# Altium schematic sheet IMX7S_SENSORS_&_EXTERNAL_INTERFACES.SchDoc
size A3
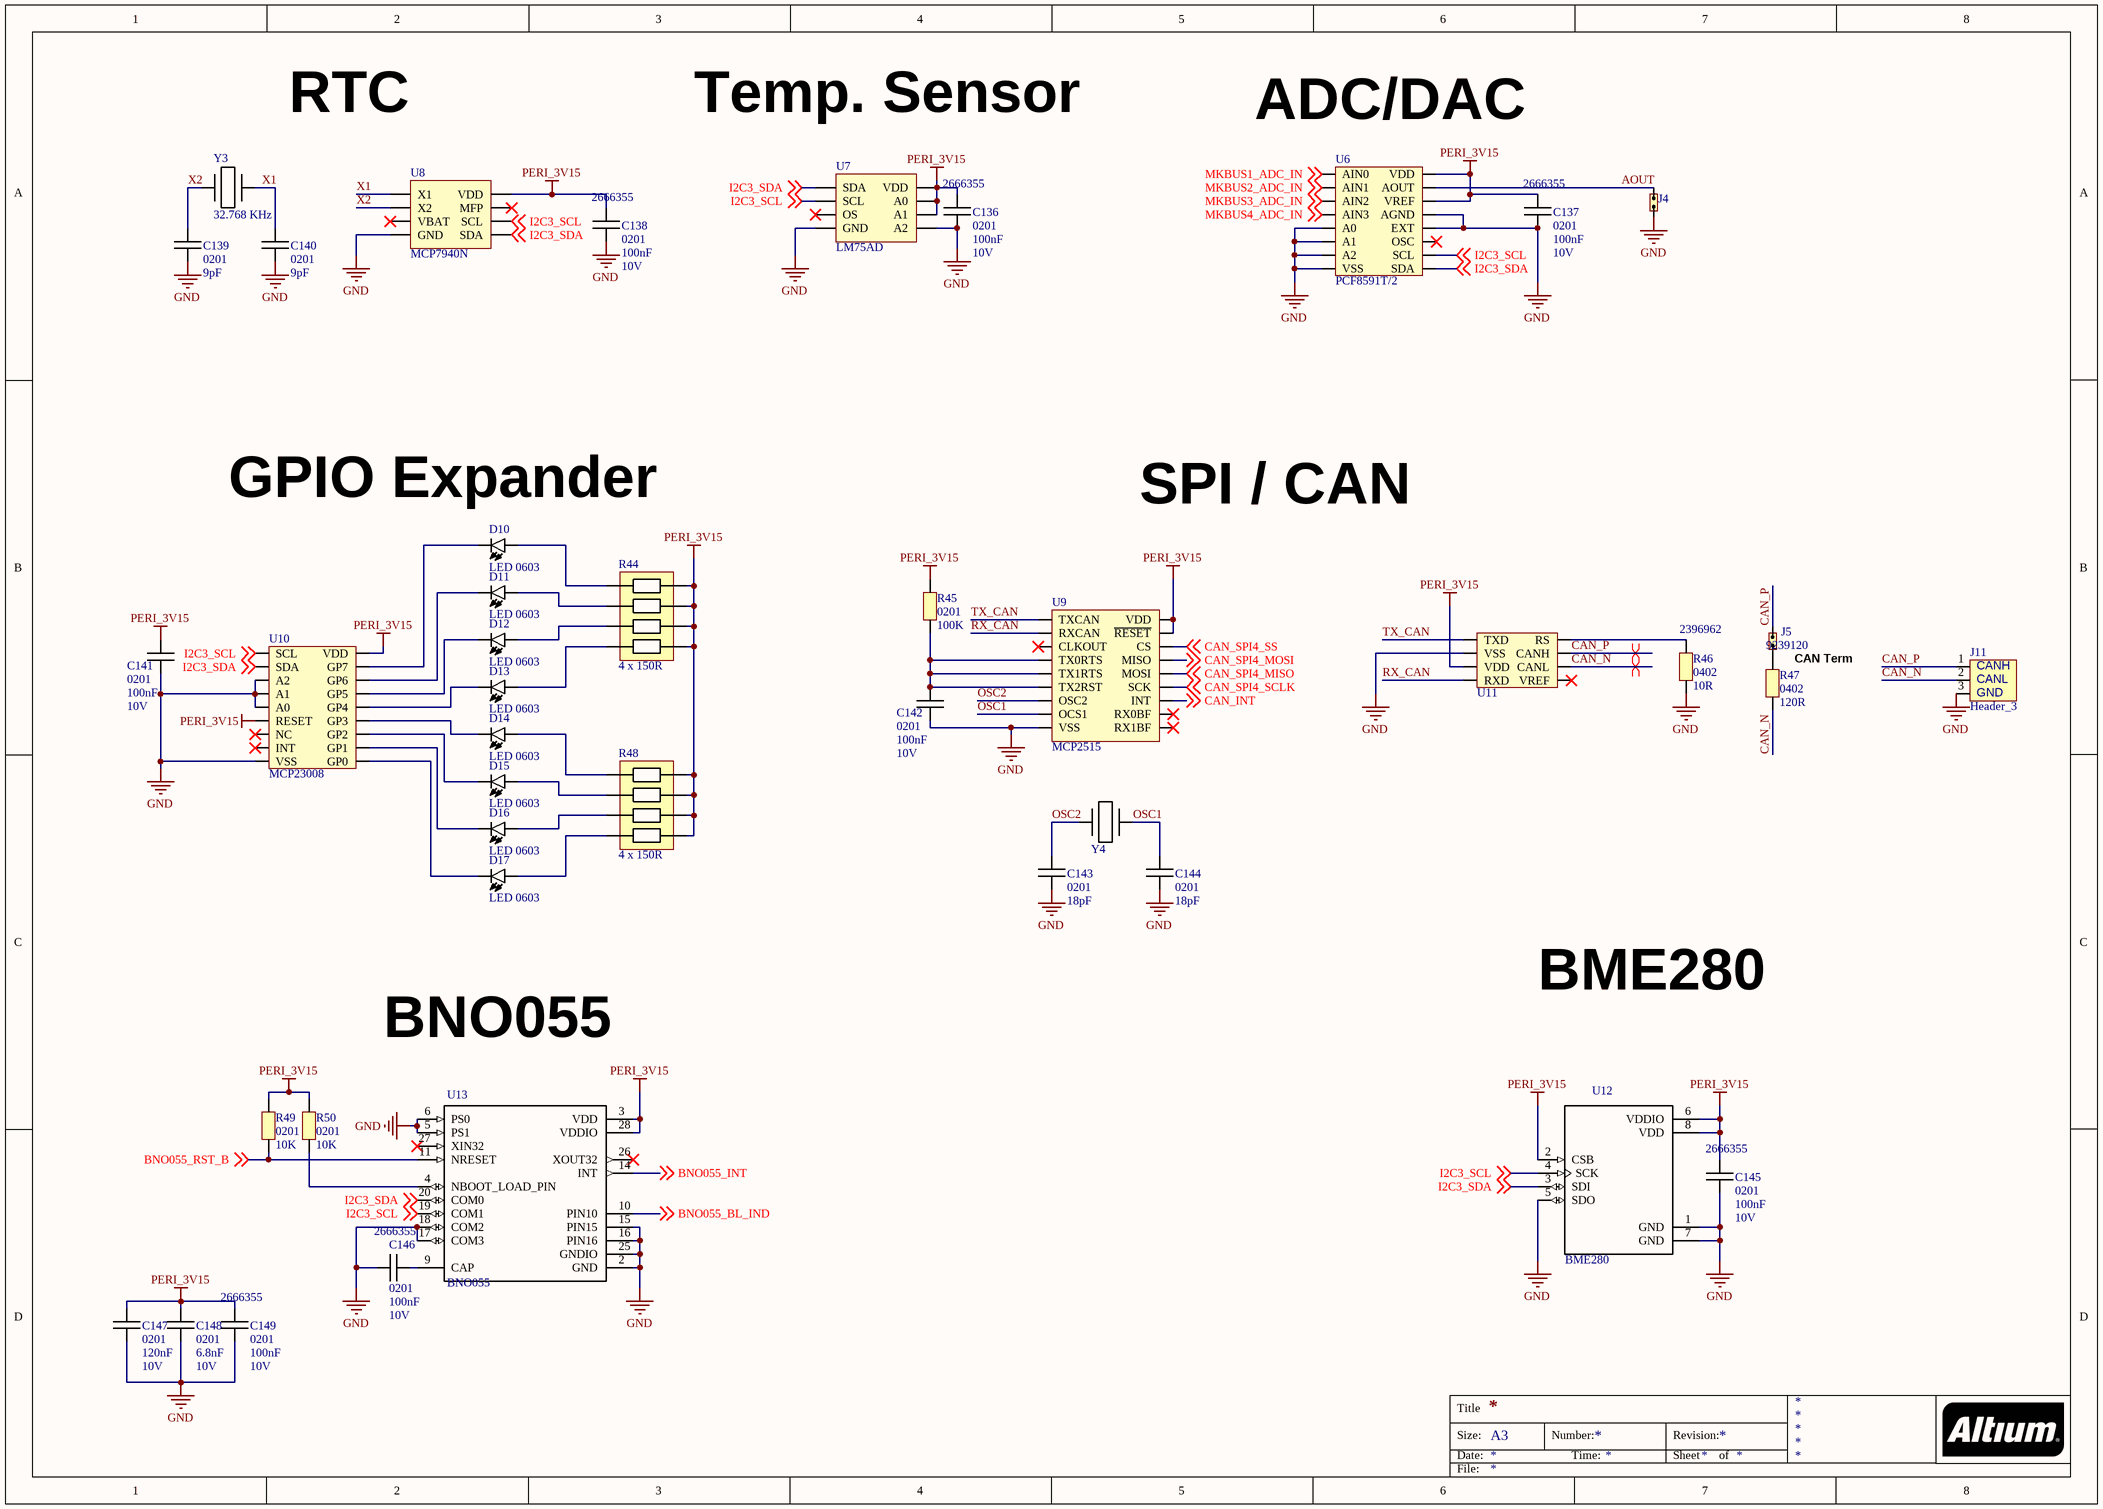
[diagram p0: IMX7S_SENSORS_&_EXTERNAL_INTERFACES.SchDoc]

## Parts
C136  value 100nF  PACKAGE: 0201  VOLTAGE: 10V  Supplier Part Number 1: 2666355  [C0201]  (hidden comment: C0201)
C137  value 100nF  PACKAGE: 0201  VOLTAGE: 10V  Supplier Part Number 1: 2666355  [C0201]  (hidden comment: C0201)
C138  value 100nF  PACKAGE: 0201  VOLTAGE: 10V  Supplier Part Number 1: 2666355  [C0201]  (hidden comment: C0201)
C139  value 9pF  PACKAGE: 0201  [C0201]  (hidden comment: C0201)
C140  value 9pF  PACKAGE: 0201  [C0201]  (hidden comment: C0201)
C141  value 100nF  PACKAGE: 0201  VOLTAGE: 10V  [C0201]  (hidden comment: C0201)
C142  value 100nF  PACKAGE: 0201  VOLTAGE: 10V  [C0201]  (hidden comment: C0201)
C143  value 18pF  PACKAGE: 0201  [C0201]  (hidden comment: C0201)
C144  value 18pF  PACKAGE: 0201  [C0201]  (hidden comment: C0201)
C145  value 100nF  PACKAGE: 0201  VOLTAGE: 10V  Supplier Part Number 1: 2666355  [C0201]  (hidden comment: C0201)
C146  value 100nF  PACKAGE: 0201  VOLTAGE: 10V  Supplier Part Number 1: 2666355  [C0201]  (hidden comment: C0201)
C147  value 120nF  PACKAGE: 0201  VOLTAGE: 10V  [C0201]  (hidden comment: C0201)
C148  value 6.8nF  PACKAGE: 0201  VOLTAGE: 10V  [C0201]  (hidden comment: C0201)
C149  value 100nF  PACKAGE: 0201  VOLTAGE: 10V  Supplier Part Number 1: 2666355  [C0201]  (hidden comment: C0201)
D10  LED 0603  [D0603]
D11  LED 0603  [D0603]
D12  LED 0603  [D0603]
D13  LED 0603  [D0603]
D14  LED 0603  [D0603]
D15  LED 0603  [D0603]
D16  LED 0603  [D0603]
D17  LED 0603  [D0603]
J4  Jumper  [Header 2]  (value not drawn)
J5  Jumper  [Header 2]  (value not drawn)
J11  Header_3  [Header 3]
R44  4 x 150R  [Reseau_R_1206]
R45  value 100K  PACKAGE: 0201  [R0201]  (hidden comment: R0201)
R46  value 10R  PACKAGE: 0402  Supplier Part Number 1: 2396962  [R0402]  (hidden comment: R0402)
R47  value 120R  PACKAGE: 0402  Supplier Part Number 1: 9239120  [R0402]  (hidden comment: R0402)
R48  4 x 150R  [Reseau_R_1206]
R49  value 10K  PACKAGE: 0201  [R0201]  (hidden comment: R0201)
R50  value 10K  PACKAGE: 0201  [R0201]  (hidden comment: R0201)
U6  PCF8591T/2  [SOIC 16]
U7  LM75AD  [SOIC 8]
U8  MCP7940N  [SOIC 8]
U9  MCP2515  [SOIC 18]
U10  MCP23008  [SOIC 18]
U11  SN65HVD230DR  [SOIC 8]  (value not drawn)
U12  BME280  [PSON65P250X250X100-8N]
U13  BNO055  [LGA28R50P4X10_380X520X100]
Y3  32.768 KHz  [ABS07]
Y4  Quartz 8MHz  [HC49]  (value not drawn)

## Nets
GND: C136.2 C137.2 C138.2 C139.1 C140.1 C141.2 C142.2 C143.1 C144.1 C145.1 C146.2 C147.2 C148.2 C149.2 J4.1 J11.3 R46.2 U6.5(A0) U6.6(A1) U6.7(A2) U6.8(VSS) U6.12(EXT) U6.13(AGND) U7.4(GND) U7.5(A2) U8.4(GND) U9.9(VSS) U10.3(A2) U10.4(A1) U10.5(A0) U10.9(VSS) U11.2(VSS) U12.1(GND) U12.5(SDO) U12.7(GND) U13.2(GND) U13.5(PS1) U13.6(PS0) U13.15(PIN15) U13.16(PIN16) U13.17(COM3) U13.18(COM2) U13.25(GNDIO)
PERI_3V15: C136.1 C137.1 C138.1 C141.1 C145.2 C147.1 C148.1 C149.1 R44.1 R44.2 R44.3 R44.4 R45.2 R48.1 R48.2 R48.3 R48.4 R49.2 R50.2 U6.14(VREF) U6.16(VDD) U7.6(A1) U7.7(A0) U7.8(VDD) U8.8(VDD) U9.17(~{RESET}) U9.18(VDD) U10.6(RESET) U10.18(VDD) U11.3(VDD) U12.2(CSB) U12.6(VDDIO) U12.8(VDD) U13.3(VDD) U13.28(VDDIO)
AOUT: J4.2 U6.15(AOUT)
BNO055_BL_IND: U13.10(PIN10) ; off-sheet BNO055_BL_IND
BNO055_INT: U13.14(INT) ; off-sheet BNO055_INT
BNO055_RST_B: R49.1 U13.11(NRESET) ; off-sheet BNO055_RST_B
CAN_INT: U9.12(INT) ; off-sheet CAN_INT
CAN_N: J11.2 R47.1 U11.6(CANL)
CAN_P: J5.2 J11.1 U11.7(CANH)
CAN_SPI4_MISO: U9.14(MOSI) ; off-sheet CAN_SPI4_MISO
CAN_SPI4_MOSI: U9.15(MISO) ; off-sheet CAN_SPI4_MOSI
CAN_SPI4_SCLK: U9.13(SCK) ; off-sheet CAN_SPI4_SCLK
CAN_SPI4_SS: U9.16(CS) ; off-sheet CAN_SPI4_SS
I2C3_SCL: U6.10(SCL) U7.2(SCL) U8.6(SCL) U10.1(SCL) U12.4(SCK) U13.19(COM1) ; off-sheet I2C3_SCL
I2C3_SDA: U6.9(SDA) U7.1(SDA) U8.5(SDA) U10.2(SDA) U12.3(SDI) U13.20(COM0) ; off-sheet I2C3_SDA
MKBUS1_ADC_IN: U6.1(AIN0) ; off-sheet MKBUS1_ADC_IN
MKBUS2_ADC_IN: U6.2(AIN1) ; off-sheet MKBUS2_ADC_IN
MKBUS3_ADC_IN: U6.3(AIN2) ; off-sheet MKBUS3_ADC_IN
MKBUS4_ADC_IN: U6.4(AIN3) ; off-sheet MKBUS4_ADC_IN
OSC1: C144.2 U9.8(OCS1) Y4.2
OSC2: C143.2 U9.7(OSC2) Y4.1
RX_CAN: U9.2(RXCAN) U11.4(RXD)
TX_CAN: U9.1(TXCAN) U11.1(TXD)
X1: C140.2 U8.1(X1) Y3.2
X2: C139.2 U8.2(X2) Y3.1
NetC142_1: C142.1 R45.1 U9.4(TX0RTS) U9.5(TX1RTS) U9.6(TX2RST)
NetC146_1: C146.1 U13.9(CAP)
NetD10_1: D10.1(A) R44.5
NetD10_2: D10.2(K) U10.17(GP7)
NetD11_1: D11.1(A) R44.6
NetD11_2: D11.2(K) U10.16(GP6)
NetD12_1: D12.1(A) R44.7
NetD12_2: D12.2(K) U10.15(GP5)
NetD13_1: D13.1(A) R44.8
NetD13_2: D13.2(K) U10.14(GP4)
NetD14_1: D14.1(A) R48.5
NetD14_2: D14.2(K) U10.13(GP3)
NetD15_1: D15.1(A) R48.6
NetD15_2: D15.2(K) U10.12(GP2)
NetD16_1: D16.1(A) R48.7
NetD16_2: D16.2(K) U10.11(GP1)
NetD17_1: D17.1(A) R48.8
NetD17_2: D17.2(K) U10.10(GP0)
NetJ5_1: J5.1 R47.2
NetR46_1: R46.1 U11.8(RS)
NetR50_1: R50.1 U13.4(NBOOT_LOAD_PIN)

Not connected (* = marked no-connect by the designer): U6 11(OSC)*; U7 3(OS)*; U8 3(VBAT)* 7(MFP)*; U9 3(CLKOUT)* 10(RX1BF)* 11(RX0BF)*; U10 7(NC)* 8(INT)*; U11 5(VREF)*; U13 26(XOUT32)* 27(XIN32)*

## Layout directives
differential pair: CAN_N, CAN_P

## Notes on the sheet
- RTC
- Temp. Sensor
- (near U6) ADC/DAC
- (near D10) GPIO Expander
- SPI / CAN
- CAN Term
- BNO055
- BME280
- Title
- Size:
- Date:
- A3
- Number:
- Time:
- Revision:
- Sheet
- of
- File:
- (in symbol Header_3) CANH; CANL; GND

## Library data of the parts
C136-C138 C145 C146 C149 = C0201: Manufacturer 1: Murata; Manufacturer Part Number 1: GRM033R61A104KE15D; Dielectric: X5R; Tolerance: 10%; Supplier 1: Farnell; Stock 1: 2430000; Pricing 1: 15000=0,00510, 75000=0,00310 (EUR); RoHS: Yes; Mount: Surface Mount; Case/Package: 0201; Weight: 6E-06oz; Case Code (Metric): 0603; Case Code (Imperial): 0201; Min Operating Temperature: -55°C; Max Operating Temperature: 85°C; Packaging: Tape and Reel; Capacitance: 100nF; Package Quantity: 1; Voltage Rating (DC): 10V; Termination: SMD/SMT; Voltage Rating: 10V; Length: 0.6mm; Height: 0.3mm; Width: 0.012inch; Thickness: 0.013inch; Depth: 0.3mm; Radiation Hardening: No; REACH SVHC: No SVHC; Lead Free: Lead Free; ComponentLink1URL: https://datasheet.ciiva.com/26843/getdatasheetpartid-308656-26843739.pdf?src-supplier=Verical; ComponentLink1Description: https://datasheet.ciiva.com/26843/getdatasheetpartid-308656-26843739.pdf?src-supplier=Verical; ComponentLink2URL: https://datasheet.ciiva.com/5413/product-5413117.pdf?src-supplier=Mouser; ComponentLink2Description: https://datasheet.ciiva.com/5413/product-5413117.pdf?src-supplier=Mouser; ComponentLink3URL: https://datasheet.ciiva.com/6256/partnumbering-e-01-6256406.pdf?src-supplier=Digi-Key; ComponentLink3Description: https://datasheet.ciiva.com/6256/partnumbering-e-01-6256406.pdf?src-supplier=Digi-Key; ComponentLink4URL: https://datasheet.ciiva.com/6256/partnumbering-e-01-6256408.pdf?src-supplier=Digi-Key; ComponentLink4Description: https://datasheet.ciiva.com/6256/partnumbering-e-01-6256408.pdf?src-supplier=Digi-Key; ComponentLink5URL: https://datasheet.ciiva.com/6256/partnumbering-e-01-6256407.pdf?src-supplier=Digi-Key; ComponentLink5Description: https://datasheet.ciiva.com/6256/partnumbering-e-01-6256407.pdf?src-supplier=Digi-Key
C139 C140 = C0201: Manufacturer 1: TDK; Manufacturer Part Number 1: CGA1A2C0G1E090D030BA; VOLTAGE: 0V; Description: CAP CER 9PF 25V C0G 0201; Voltage Rating: 25V; Dielectric: C0G; Supplier 1: RSComponents; Supplier Part Number 1: 1447034; Stock 1: 15000; Pricing 1: 15000=0,00900 (EUR); RoHS: Yes; Mount: Surface Mount; Case/Package: 0201; Weight: 6E-06oz; Case Code (Metric): 0603; Case Code (Imperial): 0201; Min Operating Temperature: -55°C; Max Operating Temperature: 125°C; Package Quantity: 1; Packaging: Tape and Reel; Capacitance: 9pF; Voltage Rating (DC): 25V; Termination: SMD/SMT; Composition: Ceramic; Length: 0.024inch; Height: 0.3mm; Width: 0.012inch; Thickness: 0.012inch; Ratings: AEC-Q200; ComponentLink1URL: http://www.mouser.com/ds/2/400/lcc_automotive_general_en-843974.pdf?src-supplier=Mouser; ComponentLink1Description: http://www.mouser.com/ds/2/400/lcc_automotive_general_en-843974.pdf?src-supplier=Mouser; ComponentLink2URL: https://product.tdk.com/info/en/documents/chara_sheet/CGA1A2C0G1E090D030BA.pdf?src-supplier=Digi-Key; ComponentLink2Description: https://product.tdk.com/info/en/documents/chara_sheet/CGA1A2C0G1E090D030BA.pdf?src-supplier=Digi-Key; ComponentLink3URL: https://product.tdk.com/info/en/catalog/datasheets/mlcc_automotive_general_en.pdf?src-supplier=Digi-Key; ComponentLink3Description: https://product.tdk.com/info/en/catalog/datasheets/mlcc_automotive_general_en.pdf?src-supplier=Digi-Key; ComponentLink4URL: http://product.tdk.com/capacitor/mlcc/en/documents/mlcc_automotive_general_en.pdf?src-supplier=Avnet; ComponentLink4Description: http://product.tdk.com/capacitor/mlcc/en/documents/mlcc_automotive_general_en.pdf?src-supplier=Avnet
C143 C144 = C0201: Manufacturer 1: Murata; Manufacturer Part Number 1: GRM0335C1H180GA01D; VOLTAGE: 10V; Description: 0201 18 pF 50 V ±2% Tolerance C0G/NP0 Multilayer Ceramic Capacitor; Voltage Rating: 50V; Tolerance: 2%; Supplier 1: Farnell; Supplier Part Number 1: 2990623; Stock 1: 11590; Pricing 1: 10=0,02610, 100=0,01320, 500=0,00970, 2500=0,00770, 7500=0,00570, 15000=0,00460, 75000=0,00310 (EUR); RoHS: Yes; Mount: Surface Mount; Case/Package: 0201; Case Code (Metric): 0603; Case Code (Imperial): 0201; Min Operating Temperature: -55°C; Max Operating Temperature: 125°C; Package Quantity: 15000; Packaging: Tape and Reel; Capacitance: 18pF; Termination: SMD/SMT; Voltage Rating (DC): 50V; Length: 0.024inch; Width: 0.012inch; Thickness: 0.013inch; ComponentLink1URL: http://www.mouser.com/ds/2/281/c02e-2905.pdf?src-supplier=Mouser; ComponentLink1Description: http://www.mouser.com/ds/2/281/c02e-2905.pdf?src-supplier=Mouser; ComponentLink2URL: http://search.murata.co.jp/Ceramy/image/img/A01X/partnumbering_e_01.pdf?src-supplier=Digi-Key; ComponentLink2Description: http://search.murata.co.jp/Ceramy/image/img/A01X/partnumbering_e_01.pdf?src-supplier=Digi-Key; ComponentLink3URL: http://search.murata.co.jp/Ceramy/image/img/A01X/G101/ENG/GRM0335C1H180GA01-01.pdf?src-supplier=Digi-Key; ComponentLink3Description: http://search.murata.co.jp/Ceramy/image/img/A01X/G101/ENG/GRM0335C1H180GA01-01.pdf?src-supplier=Digi-Key
D10-D17 = LED: Manufacturer 1: Dialight; Manufacturer Part Number 1: 597-5112-407F; Color: Red; Lens Color: White; Luminous Intensity: 11.7mcd; Viewing Angle: 152°; Forward Voltage: 1.7V; Wavelength: 660nm; Lens Style: Rectangular,Diffused; Forward Current: 20mA; Lens Transparency: Diffused; Dominant Wavelength: 647nm; Number of Elements: 1; Power Dissipation: 57.5mW; Supplier 1: Farnell; Supplier Part Number 1: 2410206; Stock 1: 4000; Pricing 1: 4000=0,23100, 8000=0,22100, 16000=0,21300 (EUR); RoHS: Yes; Mount: Surface Mount; Case/Package: 0603; Number of Pins: 2; Case Code (Metric): 1608; Case Code (Imperial): 0603; Min Operating Temperature: -30°C; Max Operating Temperature: 85°C; Packaging: Tape and Reel; Package Quantity: 1; Illumination Color: Red; Test Current: 20mA; Voltage Rating (DC): 1.7V; Input Current: 20mA; Number of LEDs: 1; Length: 1.6mm; Height: 0.7mm; Width: 0.8mm; Depth: 0.8mm; Radiation Hardening: No; REACH SVHC: No SVHC; Lead Free: Lead Free; ComponentLink1URL: https://datasheet.ciiva.com/15117/getdatasheetpartid-87981-15117375.pdf?src-supplier=Verical; ComponentLink1Description: https://datasheet.ciiva.com/15117/getdatasheetpartid-87981-15117375.pdf?src-supplier=Verical; ComponentLink2URL: https://datasheet.ciiva.com/4688/c16413e-14555-4688795.pdf?src-supplier=Mouser; ComponentLink2Description: https://datasheet.ciiva.com/4688/c16413e-14555-4688795.pdf?src-supplier=Mouser; ComponentLink3URL: https://datasheet.ciiva.com/2111/c16413-2111592.pdf?src-supplier=Digi-Key; ComponentLink3Description: https://datasheet.ciiva.com/2111/c16413-2111592.pdf?src-supplier=Digi-Key; ComponentLink4URL: https://datasheet.ciiva.com/16214/597-xxxx-4xx-16214360.pdf?src-supplier=Future+Electronics; ComponentLink4Description: https://datasheet.ciiva.com/16214/597-xxxx-4xx-16214360.pdf?src-supplier=Future+Electronics; ComponentLink5URL: https://datasheet.ciiva.com/30210/597-xxxx-4xx-30210171.pdf?src-supplier=Onlinecomponents.com; ComponentLink5Description: https://datasheet.ciiva.com/30210/597-xxxx-4xx-30210171.pdf?src-supplier=Onlinecomponents.com; ComponentLink6URL: https://datasheet.ciiva.com/16011/597-xxxx-4xx-16011468.pdf?src-supplier=Onlinecomponents.com; ComponentLink6Description: https://datasheet.ciiva.com/16011/597-xxxx-4xx-16011468.pdf?src-supplier=Onlinecomponents.com; ComponentLink7URL: https://datasheet.ciiva.com/2111/c16413-2111593.pdf?src-supplier=Digi-Key; ComponentLink7Description: https://datasheet.ciiva.com/2111/c16413-2111593.pdf?src-supplier=Digi-Key; ComponentLink8URL: https://datasheet.ciiva.com/2111/c16413-2111594.pdf?src-supplier=Digi-Key; ComponentLink8Description: https://datasheet.ciiva.com/2111/c16413-2111594.pdf?src-supplier=Digi-Key
R44 R48 = Reseau_res
R45 R49 R50 = R0201: VOLTAGE: 0V
R46 = R0402: Manufacturer 1: Panasonic; Manufacturer Part Number 1: ERJ-2RKF10R0X; VOLTAGE: 0V; Power Rating: 100mW; Tolerance: 1%; Voltage Rating: 50V; Temperature Coefficient: 100ppm/°C; Supplier 1: Farnell; Stock 1: 140000; Pricing 1: 10000=0,00410, 50000=0,00400 (GBP); RoHS: Yes; Mount: Surface Mount; Case/Package: 0402; Number of Pins: 2; Case Code (Imperial): 0402; Case Code (Metric): 1005; Contact Plating: Tin; Min Operating Temperature: -55°C; Max Operating Temperature: 155°C; Resistance: 10R; Packaging: Tape and Reel; Package Quantity: 1; Termination: SMD/SMT; Composition: Thick Film; Number of Terminations: 2; Military Standard: Not; Max Power Dissipation: 100mW; Voltage Rating (DC): 50V; Features: Automotive AEC-Q200; Length: 1mm; Height: 0.35mm; Width: 0.5mm; Depth: 0.5mm; Radiation Hardening: No; REACH SVHC: No SVHC; Lead Free: Lead Free; ComponentLink1URL: https://datasheet.ciiva.com/11821/0900766b80f80784-11821168.pdf?src-supplier=RSComponents; ComponentLink1Description: https://datasheet.ciiva.com/11821/0900766b80f80784-11821168.pdf?src-supplier=RSComponents; ComponentLink2URL: https://datasheet.ciiva.com/9194/aoa0000ce2-9194120.pdf?src-supplier=Avnet; ComponentLink2Description: https://datasheet.ciiva.com/9194/aoa0000ce2-9194120.pdf?src-supplier=Avnet; ComponentLink3URL: https://datasheet.ciiva.com/30218/aoa0000ce2-30218536.pdf?src-supplier=Onlinecomponents.com; ComponentLink3Description: https://datasheet.ciiva.com/30218/aoa0000ce2-30218536.pdf?src-supplier=Onlinecomponents.com; ComponentLink4URL: https://datasheet.ciiva.com/17212/aoa0000ce2-17212057.pdf?src-supplier=Avnet+Europe; ComponentLink4Description: https://datasheet.ciiva.com/17212/aoa0000ce2-17212057.pdf?src-supplier=Avnet+Europe; ComponentLink5URL: https://datasheet.ciiva.com/24071/aoa0000ce2-24071514.pdf?src-supplier=Mouser; ComponentLink5Description: https://datasheet.ciiva.com/24071/aoa0000ce2-24071514.pdf?src-supplier=Mouser; ComponentLink6URL: https://datasheet.ciiva.com/27055/1987054-27055644.pdf?src-supplier=Jameco; ComponentLink6Description: https://datasheet.ciiva.com/27055/1987054-27055644.pdf?src-supplier=Jameco; ComponentLink7URL: https://datasheet.ciiva.com/7802/aoa0000ce2-7802405.pdf?src-supplier=Element14; ComponentLink7Description: https://datasheet.ciiva.com/7802/aoa0000ce2-7802405.pdf?src-supplier=Element14; ComponentLink8URL: https://datasheet.ciiva.com/16773/70260748-16773366.pdf?src-supplier=Allied+Electronics; ComponentLink8Description: https://datasheet.ciiva.com/16773/70260748-16773366.pdf?src-supplier=Allied+Electronics; ComponentLink9URL: https://datasheet.ciiva.com/43467/1678782-43467127.pdf?src-supplier=Farnell; ComponentLink9Description: https://datasheet.ciiva.com/43467/1678782-43467127.pdf?src-supplier=Farnell; ComponentLink10URL: https://datasheet.ciiva.com/6082/aoa0000ce2-6082046.pdf?src-supplier=Farnell; ComponentLink10Description: https://datasheet.ciiva.com/6082/aoa0000ce2-6082046.pdf?src-supplier=Farnell; ComponentLink11URL: https://datasheet.ciiva.com/22668/1678782-22668302.pdf?src-supplier=Element14; ComponentLink11Description: https://datasheet.ciiva.com/22668/1678782-22668302.pdf?src-supplier=Element14
R47 = R0402: Manufacturer 1: Yageo; Manufacturer Part Number 1: RC0402FR-07120RL; VOLTAGE: 0V; Tolerance: 1%; Power Rating: 62.5mW; Voltage Rating: 50V; Temperature Coefficient: 100ppm/°C; Max Power Dissipation: 63mW; Supplier 1: Farnell; Stock 1: 77592; Pricing 1: 10=0,01610, 100=0,01570, 500=0,01180, 2500=0,00590, 5000=0,00500, 10000=0,00400, 50000=0,00300 (EUR); RoHS: Yes; Case/Package: 0402; Case Code (Imperial): 0402; Case Code (Metric): 1005; Min Operating Temperature: -55°C; Max Operating Temperature: 155°C; Package Quantity: 1; Resistance: 120R; Packaging: Tape and Reel; Termination: SMD/SMT; Composition: Thick Film; Number of Terminations: 2; Military Standard: Not; Features: Moisture Resistant; Length: 1mm; Height: 0.016inch; Width: 0.02inch; Depth: 0.5mm; REACH SVHC: No SVHC; Lead Free: Lead Free; ComponentLink1URL: https://datasheet.ciiva.com/11808/0900766b80c66297-11808427.pdf?src-supplier=RSComponents; ComponentLink1Description: https://datasheet.ciiva.com/11808/0900766b80c66297-11808427.pdf?src-supplier=RSComponents; ComponentLink2URL: https://datasheet.ciiva.com/7849/1018594-7849830.pdf?src-supplier=Element14; ComponentLink2Description: https://datasheet.ciiva.com/7849/1018594-7849830.pdf?src-supplier=Element14; ComponentLink3URL: https://datasheet.ciiva.com/12667/pyu-rc0402-51-rohs-l-6-r-12667958.pdf?src-supplier=Mouser; ComponentLink3Description: https://datasheet.ciiva.com/12667/pyu-rc0402-51-rohs-l-6-r-12667958.pdf?src-supplier=Mouser; ComponentLink4URL: https://datasheet.ciiva.com/7849/1018594-7849831.pdf?src-supplier=Element14; ComponentLink4Description: https://datasheet.ciiva.com/7849/1018594-7849831.pdf?src-supplier=Element14; ComponentLink5URL: https://datasheet.ciiva.com/2453/pyu-r-int-thick-7-2453469.pdf?src-supplier=Digi-Key; ComponentLink5Description: https://datasheet.ciiva.com/2453/pyu-r-int-thick-7-2453469.pdf?src-supplier=Digi-Key; ComponentLink6URL: https://datasheet.ciiva.com/2453/pyu-r-int-thick-7-2453470.pdf?src-supplier=Digi-Key; ComponentLink6Description: https://datasheet.ciiva.com/2453/pyu-r-int-thick-7-2453470.pdf?src-supplier=Digi-Key; ComponentLink7URL: https://datasheet.ciiva.com/2453/pyu-r-int-thick-7-2453471.pdf?src-supplier=Digi-Key; ComponentLink7Description: https://datasheet.ciiva.com/2453/pyu-r-int-thick-7-2453471.pdf?src-supplier=Digi-Key; ComponentLink8URL: https://datasheet.ciiva.com/17423/pyu-rc0402-51-rohs-l-6-r-17423999.pdf?src-supplier=Future+Electronics; ComponentLink8Description: https://datasheet.ciiva.com/17423/pyu-rc0402-51-rohs-l-6-r-17423999.pdf?src-supplier=Future+Electronics
U7 = LM75AD: Manufacturer 1: NXP Semiconductors; Manufacturer Part Number 1: LM75AD,118; Max Supply Voltage: 5.5V; Min Supply Voltage: 2.8V; Output Current: 10mA; Interface: I2C,SMBus,2-Wire,Serial; Resolution: 11b; Operating Supply Current: 100uA; Output Type: I2C,Digital; Supplier 1: Farnell; Supplier Part Number 1: 2776067; Stock 1: 8840; Pricing 1: 1=0,53800, 50=0,47000, 100=0,30300, 250=0,28300, 500=0,26300, 1000=0,24300, 2500=0,20500, 5000=0,19800 (EUR); RoHS: Yes; Case/Package: SOT-96-1; Number of Pins: 8; Min Operating Temperature: -55°C; Max Operating Temperature: 125°C; Packaging: Tape and Reel; Package Quantity: 2500; Max Supply Voltage (DC): 5.5V; Min Supply Voltage (DC): 2.8V; Radiation Hardening: No; Lead Free: Lead Free; ComponentLink1URL: https://datasheet.ciiva.com/5299/lm75a-51696-5299505.pdf?src-supplier=Mouser; ComponentLink1Description: https://datasheet.ciiva.com/5299/lm75a-51696-5299505.pdf?src-supplier=Mouser; ComponentLink2URL: https://datasheet.ciiva.com/27052/1342539-27052042.pdf?src-supplier=Jameco; ComponentLink2Description: https://datasheet.ciiva.com/27052/1342539-27052042.pdf?src-supplier=Jameco; ComponentLink3URL: https://datasheet.ciiva.com/15098/getdatasheetpartid-436905-15098493.pdf?src-supplier=Verical; ComponentLink3Description: https://datasheet.ciiva.com/15098/getdatasheetpartid-436905-15098493.pdf?src-supplier=Verical; ComponentLink4URL: https://datasheet.ciiva.com/26886/lm75ad-118-26886988.pdf?src-supplier=IIIC; ComponentLink4Description: https://datasheet.ciiva.com/26886/lm75ad-118-26886988.pdf?src-supplier=IIIC; ComponentLink5URL: https://datasheet.ciiva.com/8113/lm75a-8113574.pdf?src-supplier=Avnet; ComponentLink5Description: https://datasheet.ciiva.com/8113/lm75a-8113574.pdf?src-supplier=Avnet; ComponentLink6URL: https://datasheet.ciiva.com/3279/lm75a-3279194.pdf?src-supplier=Avnet; ComponentLink6Description: https://datasheet.ciiva.com/3279/lm75a-3279194.pdf?src-supplier=Avnet; ComponentLink7URL: https://datasheet.ciiva.com/16393/lm75a-16393642.pdf?src-supplier=Future+Electronics; ComponentLink7Description: https://datasheet.ciiva.com/16393/lm75a-16393642.pdf?src-supplier=Future+Electronics; ComponentLink8URL: https://datasheet.ciiva.com/16636/lm75a-16636006.pdf?src-supplier=Avnet+Europe; ComponentLink8Description: https://datasheet.ciiva.com/16636/lm75a-16636006.pdf?src-supplier=Avnet+Europe; ComponentLink9URL: https://datasheet.ciiva.com/18553/lm75a-18553614.pdf?src-supplier=Digi-Key; ComponentLink9Description: https://datasheet.ciiva.com/18553/lm75a-18553614.pdf?src-supplier=Digi-Key; ComponentLink10URL: https://datasheet.ciiva.com/18553/lm75a-18553615.pdf?src-supplier=Digi-Key; ComponentLink10Description: https://datasheet.ciiva.com/18553/lm75a-18553615.pdf?src-supplier=Digi-Key
U8 = MCP7940N: Manufacturer 1: Microchip; Manufacturer Part Number 1: MCP7940MT-I/SN; Max Supply Voltage: 5.5V; Min Supply Voltage: 1.8V; Interface: I2C,Serial,2-Wire; Memory Size: 64B; Logic Function: Clock; Time Format: HH:MM:SS; Date Format: YY-MM-DD-dd; Supplier 1: Farnell; Supplier Part Number 1: 2687514; Stock 1: 13200; Pricing 1: 3300=0,47000, 9900=0,46700 (EUR); RoHS: Yes; Mount: Surface Mount; Case/Package: SOIC; Number of Pins: 8; Min Operating Temperature: -40°C; Max Operating Temperature: 85°C; Package Quantity: 3300; Packaging: Tape and Reel; Radiation Hardening: No; ComponentLink1URL: https://datasheet.ciiva.com/8145/22292a-8145022.pdf?src-supplier=Avnet; ComponentLink1Description: https://datasheet.ciiva.com/8145/22292a-8145022.pdf?src-supplier=Avnet
U9 = MCP2515: Manufacturer 1: Microchip; Manufacturer Part Number 1: MCP2515-I/SO; Interface: SPI,CAN; Number of Transmit Buffers: 3; Number of Receive Buffers: 2; Min Supply Voltage: 2.7V; Max Supply Voltage: 5.5V; Data Rate: 1Mbps; Nominal Supply Current: 10mA; Operating Supply Voltage: 5V; Number of Transceivers: 1; Frequency: 40MHz; Supplier 1: Farnell; Supplier Part Number 1: 1292239; Stock 1: 5399; Pricing 1: 1=1,63000, 10=1,54000, 25=1,35000, 100=1,24000 (EUR); RoHS: Yes; Mount: Surface Mount; Case/Package: SOIC; Number of Pins: 18; Contact Plating: Tin,Matte; Min Operating Temperature: -40°C; Max Operating Temperature: 85°C; Packaging: Rail/Tube; Max Supply Current: 10mA; Number of Drivers: 1; Number of Receivers: 1; Length: 11.53mm; Height: 2.31mm; Width: 7.49mm; Radiation Hardening: No; Lead Free: Lead Free; REACH SVHC: No SVHC; ComponentLink1URL: https://datasheet.ciiva.com/14152/ea644222-e-14152533.pdf?src-supplier=Distrelec; ComponentLink1Description: https://datasheet.ciiva.com/14152/ea644222-e-14152533.pdf?src-supplier=Distrelec; ComponentLink2URL: https://datasheet.ciiva.com/15150/getdatasheetpartid-446809-15150054.pdf?src-supplier=Verical; ComponentLink2Description: https://datasheet.ciiva.com/15150/getdatasheetpartid-446809-15150054.pdf?src-supplier=Verical; ComponentLink3URL: https://datasheet.ciiva.com/1695/21801g-1695405.pdf?src-supplier=Digi-Key; ComponentLink3Description: https://datasheet.ciiva.com/1695/21801g-1695405.pdf?src-supplier=Digi-Key; ComponentLink4URL: https://datasheet.ciiva.com/16205/filehandler-aspxddocname-en011733-16205222.pdf?src-supplier=Future+Electronics; ComponentLink4Description: https://datasheet.ciiva.com/16205/filehandler-aspxddocname-en011733-16205222.pdf?src-supplier=Future+Electronics; ComponentLink5URL: https://datasheet.ciiva.com/18405/70045398-18405546.pdf?src-supplier=Allied+Electronics; ComponentLink5Description: https://datasheet.ciiva.com/18405/70045398-18405546.pdf?src-supplier=Allied+Electronics; ComponentLink6URL: https://datasheet.ciiva.com/1495/1669372-1495083.pdf?src-supplier=Element14; ComponentLink6Description: https://datasheet.ciiva.com/1495/1669372-1495083.pdf?src-supplier=Element14; ComponentLink7URL: https://datasheet.ciiva.com/29305/651448-da-01-en-ic-can-cont-mcp2515-i-so-soic-18-mcp-29305158.pdf?src-supplier=Conrad; ComponentLink7Description: https://datasheet.ciiva.com/29305/651448-da-01-en-ic-can-cont-mcp2515-i-so-soic-18-mcp-29305158.pdf?src-supplier=Conrad
U10 = MCP23008: Manufacturer 1: NXP Semiconductors; Manufacturer Part Number 1: PCF8591T/2,518; Number of Bits: 8; Interface: I2C,Serial; Number of Channels: 1; Max Supply Voltage: 6V; Min Supply Voltage: 2.5V; Power Consumption: 300mW; Sampling Rate: 11.1KS/s; Resolution: 8b; Signal to Noise Ratio (SNR): 40dB; Supplier 1: Farnell; Supplier Part Number 1: 2400442; Stock 1: 380; Pricing 1: 1=3,09000, 10=2,32000, 25=2,21000, 50=2,12000, 100=2,02000, 250=1,91000, 500=1,72000, 1000=1,37000 (EUR); RoHS: Yes; Mount: Surface Mount; Case/Package: SO; Number of Pins: 16; Contact Plating: Gold; Min Operating Temperature: -40°C; Max Operating Temperature: 85°C; Packaging: Tape and Reel; Number of Converters: 1; Number of A/D Converters: 1; Number of D/A Converters: 1; Type: General Purpose; Radiation Hardening: No; REACH SVHC: No SVHC; Lead Free: Lead Free; ComponentLink1URL: https://datasheet.ciiva.com/3030/pcf8591-3030705.pdf?src-supplier=Avnet; ComponentLink1Description: https://datasheet.ciiva.com/3030/pcf8591-3030705.pdf?src-supplier=Avnet; ComponentLink2URL: https://datasheet.ciiva.com/27052/1455488-27052242.pdf?src-supplier=Jameco; ComponentLink2Description: https://datasheet.ciiva.com/27052/1455488-27052242.pdf?src-supplier=Jameco; ComponentLink3URL: https://datasheet.ciiva.com/26795/pcf8591t-2-518-26795842.pdf?src-supplier=IIIC; ComponentLink3Description: https://datasheet.ciiva.com/26795/pcf8591t-2-518-26795842.pdf?src-supplier=IIIC; ComponentLink4URL: https://datasheet.ciiva.com/3030/pcf8591-3030627.pdf?src-supplier=Avnet; ComponentLink4Description: https://datasheet.ciiva.com/3030/pcf8591-3030627.pdf?src-supplier=Avnet; ComponentLink5URL: https://datasheet.ciiva.com/16289/pcf8591-16289017.pdf?src-supplier=Future+Electronics; ComponentLink5Description: https://datasheet.ciiva.com/16289/pcf8591-16289017.pdf?src-supplier=Future+Electronics; ComponentLink6URL: https://datasheet.ciiva.com/16470/pcf8591-16470118.pdf?src-supplier=Avnet+Asia; ComponentLink6Description: https://datasheet.ciiva.com/16470/pcf8591-16470118.pdf?src-supplier=Avnet+Asia; ComponentLink7URL: https://datasheet.ciiva.com/46381/1759207-46381804.pdf?src-supplier=Element14; ComponentLink7Description: https://datasheet.ciiva.com/46381/1759207-46381804.pdf?src-supplier=Element14; ComponentLink8URL: https://datasheet.ciiva.com/15152/getdatasheetpartid-117416-15152171.pdf?src-supplier=Verical; ComponentLink8Description: https://datasheet.ciiva.com/15152/getdatasheetpartid-117416-15152171.pdf?src-supplier=Verical
U11 = SN65HVD230DR: Manufacturer 1: Texas Instruments; Data Rate: 1Mbps; Min Supply Voltage: 3V; Max Supply Voltage: 3.6V; Number of Transmit Buffers: 1; Nominal Supply Current: 17mA; Operating Supply Voltage: 3.3V; Number of I/Os: 2; Supplier 1: Farnell; Supplier Part Number 1: 2395479; Manufacturer Part Number 1: SN65HVD230DR; Stock 1: 2823; Pricing 1: 1=2,05000, 10=1,78000, 100=1,42000, 500=1,24000, 1000=1,03000 (EUR); RoHS: Yes; Case/Package: D; Number of Pins: 8; Weight: 0.002561oz; Contact Plating: Gold; Min Operating Temperature: -40°C; Max Operating Temperature: 85°C; Packaging: Tape and Reel; Package Quantity: 1; Termination: SMD/SMT; Number of Receive Buffers: 1; Number of Receivers: 1; Number of Transceivers: 1; Number of Drivers: 1; Max Supply Current: 17mA; Radiation Hardening: No; REACH SVHC: No SVHC; Lead Free: Lead Free; ComponentLink1URL: https://datasheet.ciiva.com/3303/slos346k-3303008.pdf?src-supplier=Avnet; ComponentLink1Description: https://datasheet.ciiva.com/3303/slos346k-3303008.pdf?src-supplier=Avnet; ComponentLink2URL: https://datasheet.ciiva.com/27052/1495682-27052294.pdf?src-supplier=Jameco; ComponentLink2Description: https://datasheet.ciiva.com/27052/1495682-27052294.pdf?src-supplier=Jameco; ComponentLink3URL: https://datasheet.ciiva.com/4781/sn65hvd230-86923-4781328.pdf?src-supplier=Mouser; ComponentLink3Description: https://datasheet.ciiva.com/4781/sn65hvd230-86923-4781328.pdf?src-supplier=Mouser; ComponentLink4URL: https://datasheet.ciiva.com/28652/1695240-28652369.pdf?src-supplier=Element14; ComponentLink4Description: https://datasheet.ciiva.com/28652/1695240-28652369.pdf?src-supplier=Element14; ComponentLink5URL: https://datasheet.ciiva.com/1705/sn65hvd230-1705286.pdf?src-supplier=Digi-Key; ComponentLink5Description: https://datasheet.ciiva.com/1705/sn65hvd230-1705286.pdf?src-supplier=Digi-Key; ComponentLink6URL: https://datasheet.ciiva.com/1705/sn65hvd230-1705288.pdf?src-supplier=Digi-Key; ComponentLink6Description: https://datasheet.ciiva.com/1705/sn65hvd230-1705288.pdf?src-supplier=Digi-Key; ComponentLink7URL: https://datasheet.ciiva.com/22694/1887486-22694362.pdf?src-supplier=Element14; ComponentLink7Description: https://datasheet.ciiva.com/22694/1887486-22694362.pdf?src-supplier=Element14; ComponentLink8URL: https://datasheet.ciiva.com/15150/getdatasheetpartid-393721-15150028.pdf?src-supplier=Verical; ComponentLink8Description: https://datasheet.ciiva.com/15150/getdatasheetpartid-393721-15150028.pdf?src-supplier=Verical; ComponentLink9URL: https://datasheet.ciiva.com/1705/sn65hvd230-1705287.pdf?src-supplier=Digi-Key; ComponentLink9Description: https://datasheet.ciiva.com/1705/sn65hvd230-1705287.pdf?src-supplier=Digi-Key
U12 = BME280: Integrated pressure, humidity and temperature sensor; 8-pin 2.5x2.5x0.93mm LGA; MF: Bosch; MP: BME280; Package: LGA-8 Bosch; Price: None; Availability: Unavailable; SnapEDA_Link: https://www.snapeda.com/parts/BME280/Bosch%20Sensortec/view-part/?ref=snap; Value: *; Supplier 1: Mouser; Supplier Part Number 1: 262-BME280; Manufacturer 1: Bosch; Manufacturer Part Number 1: BME280; Stock 1: 4044; Pricing 1: 1=3,73000, 10=3,73000, 50=3,66000, 100=3,57000, 500=2,73000, 1000=2,52000, 5000=2,43000, 10000=2,19000 (USD); RoHS: No; Case/Package: LGA; Number of Pins: 8; Lead Free: Lead Free; ComponentLink1URL: https://ae-bst.resource.bosch.com/media/_tech/media/product_flyer/BME280_Productflyer_BST_20170109.pdf?src-supplier=Future+Electronics; ComponentLink1Description: https://ae-bst.resource.bosch.com/media/_tech/media/product_flyer/BME280_Productflyer_BST_20170109.pdf?src-supplier=Future+Electronics; ComponentLink2URL: https://ae-bst.resource.bosch.com/media/_tech/media/datasheets/BST-BME280-DS002.pdf?src-supplier=Digi-Key; ComponentLink2Description: https://ae-bst.resource.bosch.com/media/_tech/media/datasheets/BST-BME280-DS002.pdf?src-supplier=Digi-Key; ComponentLink3URL: https://ae-bst.resource.bosch.com/media/_tech/media/product_flyer/BME280_Productflyer_BST_20170109.pdf?src-supplier=Arrow; ComponentLink3Description: https://ae-bst.resource.bosch.com/media/_tech/media/product_flyer/BME280_Productflyer_BST_20170109.pdf?src-supplier=Arrow; ComponentLink4URL: https://ae-bst.resource.bosch.com/media/_tech/media/product_flyer/BME280_Productflyer_BST_20170109.pdf?src-supplier=Mouser; ComponentLink4Description: https://ae-bst.resource.bosch.com/media/_tech/media/product_flyer/BME280_Productflyer_BST_20170109.pdf?src-supplier=Mouser; ComponentLink5URL: https://ae-bst.resource.bosch.com/media/_tech/media/product_flyer/BME280_Productflyer_BST_20170109.pdf?src-supplier=Rutronik; ComponentLink5Description: https://ae-bst.resource.bosch.com/media/_tech/media/product_flyer/BME280_Productflyer_BST_20170109.pdf?src-supplier=Rutronik; ComponentLink6URL: https://ae-bst.resource.bosch.com/media/_tech/media/product_flyer/BME280_Productflyer_BST_20170109.pdf?src-supplier=NAC+Semi; ComponentLink6Description: https://ae-bst.resource.bosch.com/media/_tech/media/product_flyer/BME280_Productflyer_BST_20170109.pdf?src-supplier=NAC+Semi
U13 = BNO055: BNO055 9-axis Absolute Orientation Sensor _ SiP _ w/Sensors and Sensor Fusion; MF: Bosch; SnapEDA_Link: https://www.snapeda.com/parts/BNO055/Bosch%20Sensortec/view-part/?ref=snap; Availability: Unavailable; Price: None; MP: BNO055; Package: LGA-28 Bosch; Value: *; Supplier 1: Mouser; Supplier Part Number 1: 262-BNO055; Manufacturer 1: Bosch; Manufacturer Part Number 1: BNO055; Stock 1: 8766; Pricing 1: 1=10,06000, 10=7,53000, 25=6,71000, 50=6,15000, 100=5,63000, 1000=5,63000, 4000=5,03000, 10000=5,03000 (USD); RoHS: No; Case/Package: LGA; Lead Free: Lead Free; ComponentLink1URL: https://ae-bst.resource.bosch.com/media/_tech/media/application_notes/BST-BNO055-HS000.pdf ?src-supplier=Digi-Key; ComponentLink1Description: https://ae-bst.resource.bosch.com/media/_tech/media/application_notes/BST-BNO055-HS000.pdf ?src-supplier=Digi-Key
Y3 = Quartz 32.768: Supplier 1: Farnell; Supplier Part Number 1: 2819305
Y4 = Quartz 8MHz: Supplier 1: Farnell; Supplier Part Number 1: 2467757